# Altium schematic sheet OUTPUT.SchDoc
size A3; SheetNumber: 1; SheetTotal: 1
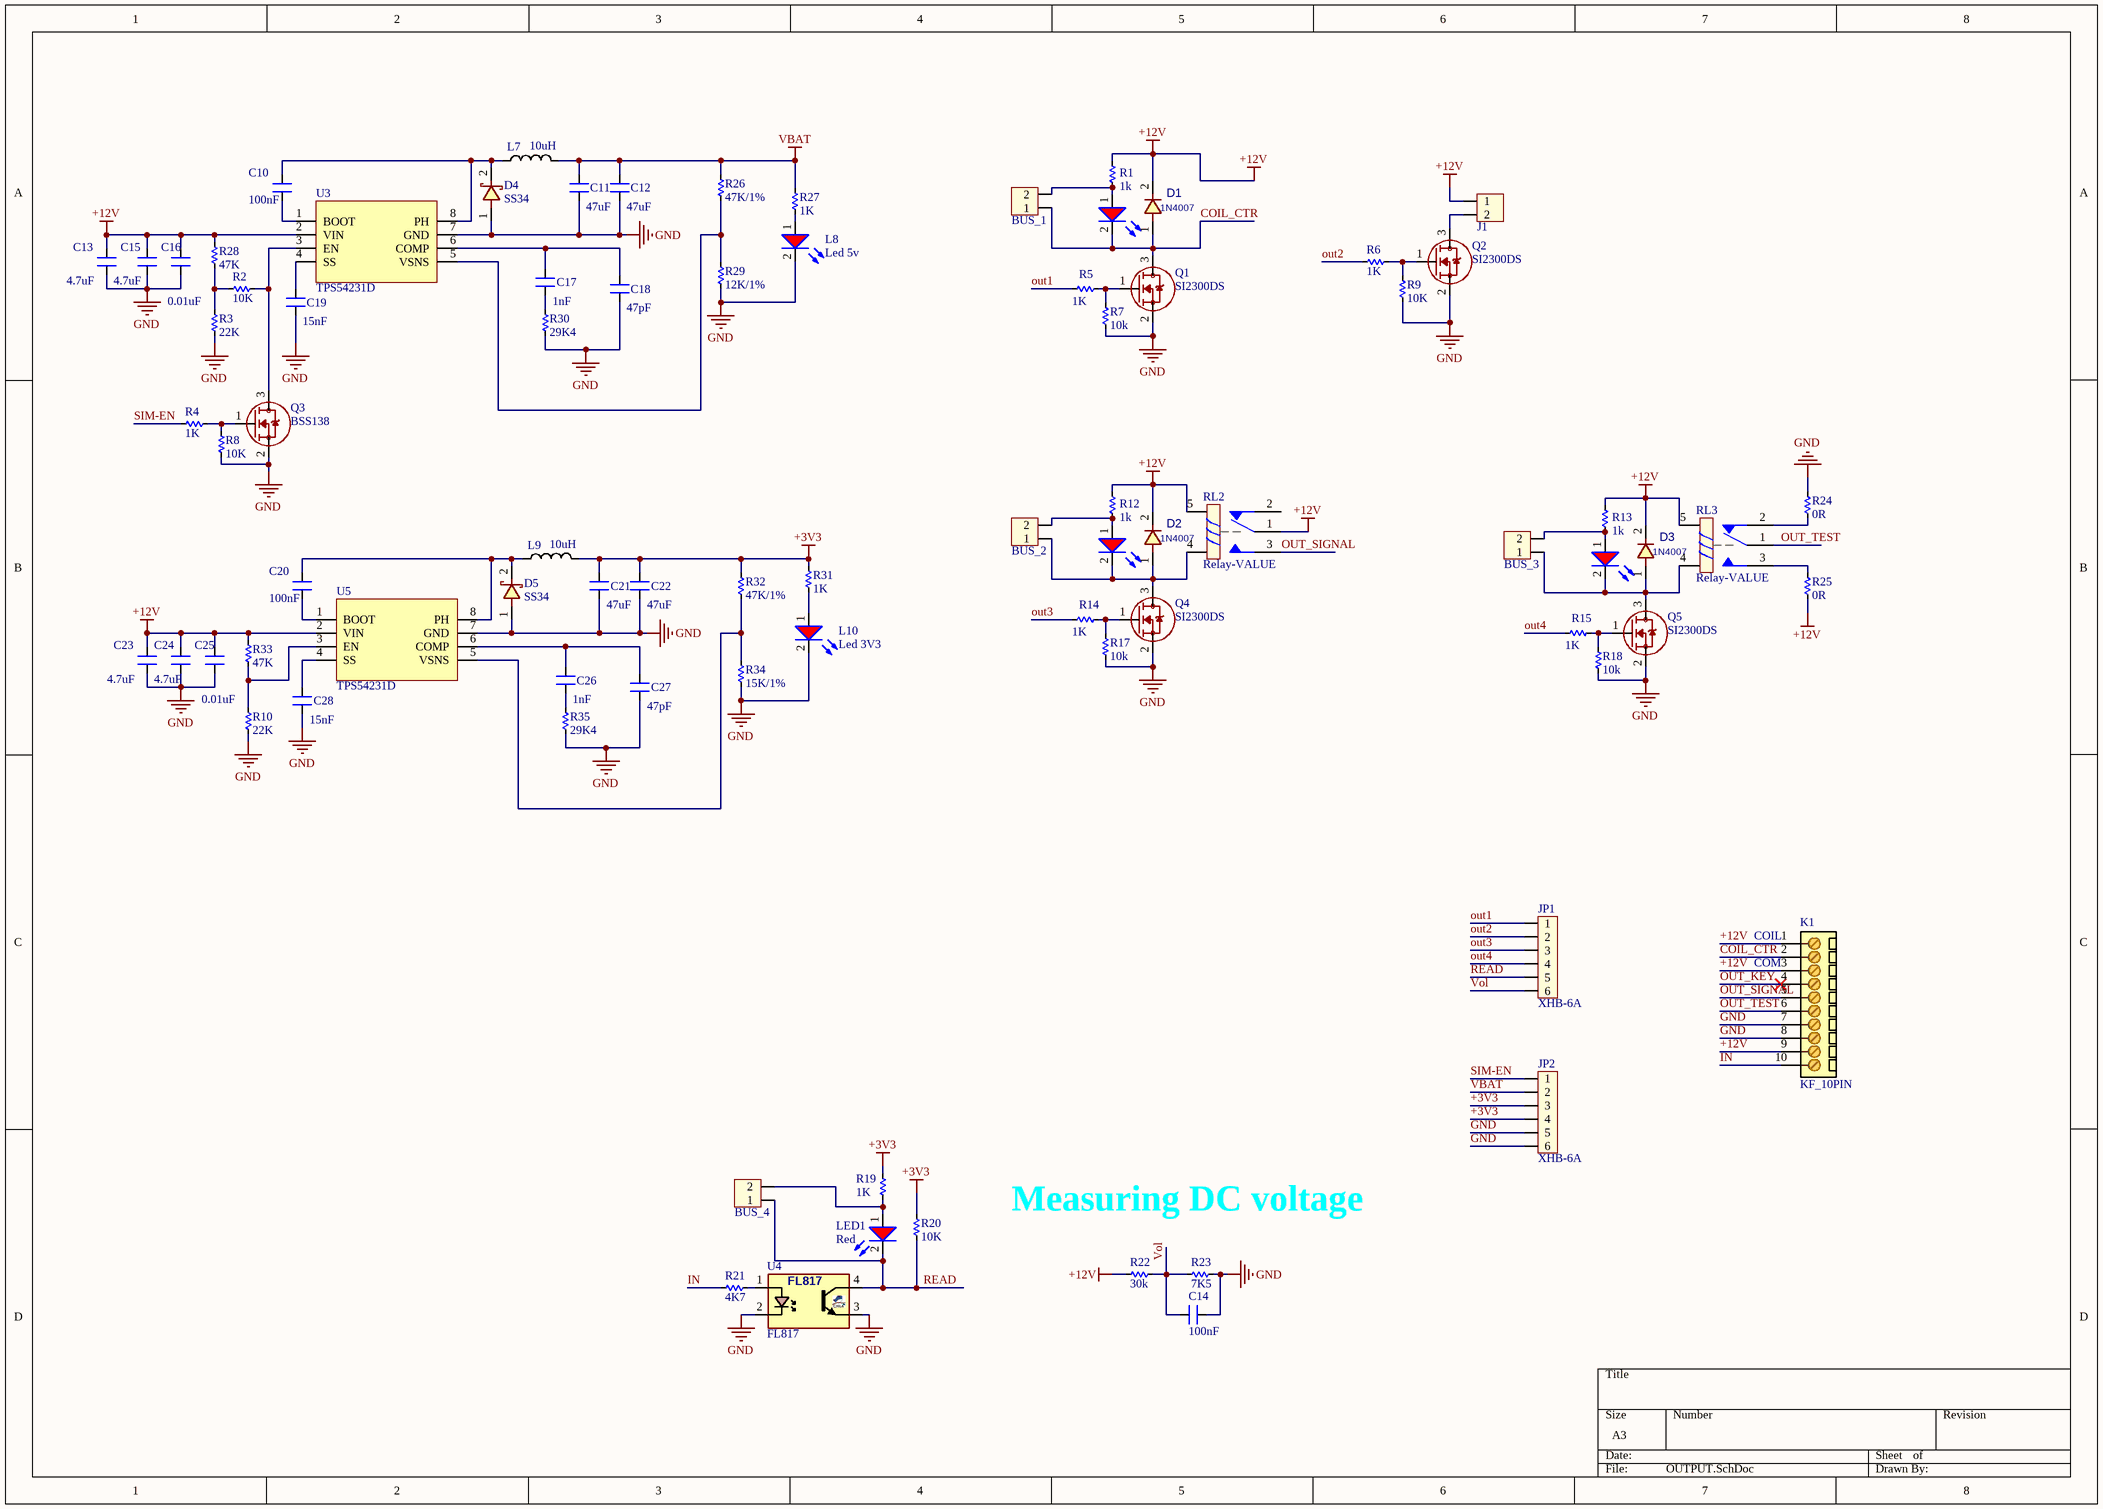
[diagram p0: OUTPUT.SchDoc]

## Parts
BUS_1  BUS_2PIN  [CON2]  (value not drawn)
BUS_2  BUS_2PIN  [CON2]  (value not drawn)
BUS_3  BUS_2PIN  [CON2]  (value not drawn)
BUS_4  BUS_2PIN  [CON2]  (value not drawn)
C10  100nF  [CAP-0603]
C11  47uF  [Cap-0805]
C12  47uF  [Cap-0805]
C13  4.7uF  [Cap-0805]
C14  100nF  [CAP-0603]
C15  4.7uF  [Cap-0805]
C16  0.01uF  [CAP-0603]
C17  1nF  [CAP-0603]
C18  47pF  [CAP-0603]
C19  15nF  [CAP-0603]
C20  100nF  [CAP-0603]
C21  47uF  [Cap-0805]
C22  47uF  [Cap-0805]
C23  4.7uF  [Cap-0805]
C24  4.7uF  [Cap-0805]
C25  0.01uF  [CAP-0603]
C26  1nF  [CAP-0603]
C27  47pF  [CAP-0603]
C28  15nF  [CAP-0603]
D1  1N4007  [SOD-323]
D2  1N4007  [SOD-323]
D3  1N4007  [SOD-323]
D4  SS34  [SS34]
D5  SS34  [SS34]
J1  BUS_2PIN  [CON2]  (value not drawn)
JP1  XHB-6A  [XH2.54-6P_THRU]
JP2  XHB-6A  [XH2.54-6P_THRU]
K1  KF_10PIN  [DOMINO-10PIN_3.5mm]
L2  LED_R_1  [LED_0805_smd]  (value not drawn)
L4  LED_R_1  [LED_0805_smd]  (value not drawn)
L5  LED_R_1  [LED_0805_smd]  (value not drawn)
L7  10uH  [INDUCTOR-06030]
L8  value Led 5v  [LED_0805_smd]  (hidden comment: LED)
L9  10uH  [INDUCTOR-06030]
L10  value Led 3V3  [LED_0805_smd]  (hidden comment: LED)
LED1  value Red  [LED_0805_smd]  (hidden comment: SMD)
Q1  SI2300DS  [SOT-23]
Q2  SI2300DS  [SOT-23]
Q3  BSS138  [SOT-23]
Q4  SI2300DS  [SOT-23]
Q5  SI2300DS  [SOT-23]
R1  1k  [RES-0603]
R2  10K  [RES-0603]
R3  22K  [RES-0603]
R4  1K  [RES-0603]
R5  1K  [RES-0603]
R6  1K  [RES-0603]
R7  10k  [RES-0603]
R8  10K  [RES-0603]
R9  10K  [RES-0603]
R10  22K  [RES-0603]
R12  1k  [RES-0603]
R13  1k  [RES-0603]
R14  1K  [RES-0603]
R15  1K  [RES-0603]
R17  10k  [RES-0603]
R18  10k  [RES-0603]
R19  1K  [RES-0603]
R20  10K  [RES-0603]
R21  4K7  [RES-0603]
R22  30k  [RES-0603]
R23  7K5  [RES-0603]
R24  0R  [RES-1206]
R25  0R  [RES-1206]
R26  47K/1%  [RES-0603]
R27  1K  [RES-0603]
R28  47K  [RES-0603]
R29  12K/1%  [RES-0603]
R30  29K4  [RES-0603]
R31  1K  [RES-0603]
R32  47K/1%  [RES-0603]
R33  47K  [RES-0603]
R34  15K/1%  [RES-0603]
R35  29K4  [RES-0603]
RL2  Relay-VALUE  [RL-20A]
RL3  Relay-VALUE  [RL-20A]
U3  TPS54231D  [SOIC-8]
U4  FL817  [OPTO-PC817]
U5  TPS54231D  [SOIC-8]

## Nets
+3V3: C21.2 C22.2 JP2.3 JP2.4 L9.2 R19.2 R20.1 R31.1 R32.1
+12V: C13.2 C15.2 C16.2 C23.2 C24.2 C25.2 D1.2 D2.2 D3.2 J1.1 K1.1 K1.3 K1.9 R1.2 R12.2 R13.2 R22.2 R25.2 R28.1 R33.1 RL2.1 RL2.5 RL3.5 U3.2(VIN) U5.2(VIN)
GND: C11.1 C12.1 C13.1 C14.1 C15.1 C16.1 C18.1 C19.1 C21.1 C22.1 C23.1 C24.1 C25.1 C27.1 C28.1 D4.1 D5.1 JP2.5 JP2.6 K1.7 K1.8 L8.2(K) L10.2(K) Q1.2(S) Q2.2(S) Q3.2(S) Q4.2(S) Q5.2(S) R3.2 R7.2 R8.1 R9.2 R10.2 R17.2 R18.2 R23.1 R24.1 R29.2 R30.2 R34.2 R35.2 U3.7(GND) U4.2(K) U4.3(E) U5.7(GND)
VBAT: C11.2 C12.2 JP2.2 L7.2 R26.1 R27.1
COIL_CTR: BUS_1.1 D1.1 K1.2 L2.2(K) Q1.3(D)
IN: K1.10 R21.2
out1: JP1.1 R5.2
out2: JP1.2 R6.2
out3: JP1.3 R14.2
out4: JP1.4 R15.2
OUT_KEY: K1.4
OUT_SIGNAL: K1.5 RL2.3
OUT_TEST: K1.6 RL3.1
READ: BUS_4.1 JP1.5 LED1.2(K) R20.2 U4.4(C)
SIM-EN: JP2.1 R4.1
Vol: C14.2 JP1.6 R22.1 R23.2
NetBUS_1_2: BUS_1.2 L2.1(A) R1.1
NetBUS_2_1: BUS_2.1 D2.1 L4.2(K) Q4.3(D) RL2.4
NetBUS_2_2: BUS_2.2 L4.1(A) R12.1
NetBUS_3_1: BUS_3.1 D3.1 L5.2(K) Q5.3(D) RL3.4
NetBUS_3_2: BUS_3.2 L5.1(A) R13.1
NetBUS_4_2: BUS_4.2 LED1.1(A) R19.1
NetC10_1: C10.1 U3.1(BOOT)
NetC10_2: C10.2 D4.2 L7.1 U3.8(PH)
NetC17_1: C17.1 R30.1
NetC17_2: C17.2 C18.2 U3.6(COMP)
NetC19_2: C19.2 U3.4(SS)
NetC20_1: C20.1 U5.1(BOOT)
NetC20_2: C20.2 D5.2 L9.1 U5.8(PH)
NetC26_1: C26.1 R35.1
NetC26_2: C26.2 C27.2 U5.6(COMP)
NetC28_2: C28.2 U5.4(SS)
NetJ1_2: J1.2 Q2.3(D)
NetL8_1: L8.1(A) R27.2
NetL10_1: L10.1(A) R31.2
NetQ1_1: Q1.1(G) R5.1 R7.1
NetQ2_1: Q2.1(G) R6.1 R9.1
NetQ3_1: Q3.1(G) R4.2 R8.2
NetQ3_3: Q3.3(D) R2.2 U3.3(EN)
NetQ4_1: Q4.1(G) R14.1 R17.1
NetQ5_1: Q5.1(G) R15.1 R18.1
NetR2_1: R2.1 R3.1 R28.2
NetR10_1: R10.1 R33.2 U5.3(EN)
NetR21_1: R21.1 U4.1(A)
NetR24_2: R24.2 RL3.2
NetR25_1: R25.1 RL3.3
NetR26_2: R26.2 R29.1 U3.5(VSNS)
NetR32_2: R32.2 R34.1 U5.5(VSNS)

Not connected (* = marked no-connect by the designer): RL2 2

## Notes on the sheet
- (near K1) COIL
- (near K1) COM
- Measuring DC voltage

## Library data of the parts
BUS_1-BUS_4 J1 = CON2: Connector 2; Value: Connector 2
C10-C28 = CAP CERAMIC: Cap np W0.3; Value: 0,047uF; Copyright: VanDungEvn
D1-D3 = 1N4007: DIODE, GENERAL PURPOSE, 1000V/1A; MANF: Diodes; DESC: DESCRIPTION; PARAM: 1000V, 1.15V; PARAM2: 1.5A; ASSEMBLY: ASSEMBLY; PRICE: PRICE; MANF_P#: 1N4007; VALUE: 1N4007
D4 D5 = DIODE_SCHOKY
JP1 JP2 = JP6: JP6 PIN; Value: JP7
L2 L4 L5 = LED_RED_3MM: LED Red 3mm/5MM; ComponentLink1Description: Datasheet; ComponentLink1URL: D:\Dropbox\Datasheets\Opto and Illumination\LEDs\SMD LED.pdf; Unit Price: 0.0476; Value: Red
L7 L9 = IN
L8 L10 = LED_RED_SMD: ComponentLink1Description: Datasheet; ComponentLink1URL: D:\Dropbox\Datasheets\Opto and Illumination\LEDs\SMD LED.pdf; Unit Price: 0.0476
LED1 = LED_RED_SMD: LED Red 3mm/5MM; ComponentLink1Description: Datasheet; ComponentLink1URL: D:\Dropbox\Datasheets\Opto and Illumination\LEDs\SMD LED.pdf; Unit Price: 0.0476
Q1 Q4 Q5 = MOSFET_SI2300DS: MOSFET N-CH 3.6A 30V
Q2 = MOSFET-N_SI2300DS: MOSFET N-CH 3.6A 30V
Q3 = MOSFET-N_BSS138: MOSFET N-CH 0.2A-50V
R1-R10 R12-R15 R17-R35 = Res: Manufacturer: Generic Components; Class: Passive; SubClass: R; Published: 08/06/2000; Publisher: Altium Hobart Technology Centre
RL2 RL3 = Relay-SONGLE: Relay SPDT; Value: Relay SPDT, 10A, 12V
U3 U5 = TPS54231D: IC BUCK @TE
U4 = OPTO-PC817: OPTOCOUPLER, TRANSISTOR, 4PIN; PRICE: PRICE; VALUE: FL817